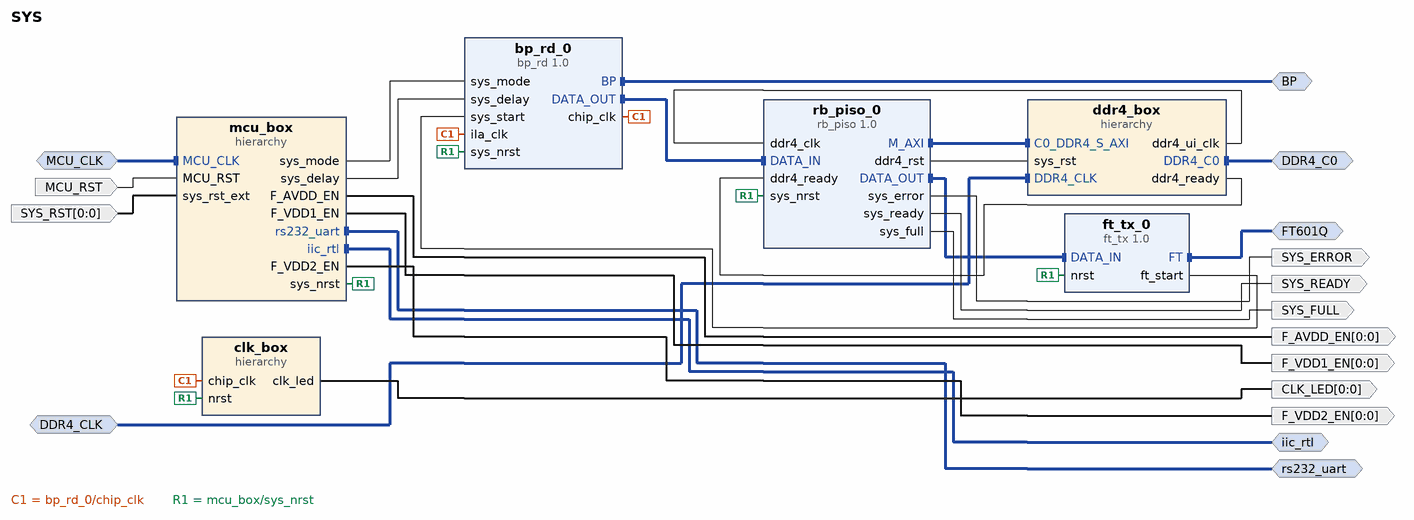
[diagram p0: block diagram of the top level]
# Vivado block design SYS, xcvu9p-flga2104-2L-e, Vivado 2019.1
create_bd_design SYS

create_bd_intf_port -mode Master -vlnv xilinx.com:user:FT601Q_rtl:1.0 FT601Q
create_bd_intf_port -mode Master -vlnv xilinx.com:user:BlackPearl_rtl:1.0 BP
create_bd_intf_port -mode Master -vlnv xilinx.com:interface:ddr4_rtl:1.0 DDR4_C0
create_bd_intf_port -mode Slave -vlnv xilinx.com:interface:diff_clock_rtl:1.0 DDR4_CLK
set_property -dict {CONFIG.FREQ_HZ 250000000} [get_bd_intf_ports DDR4_CLK]
create_bd_intf_port -mode Slave -vlnv xilinx.com:interface:diff_clock_rtl:1.0 MCU_CLK
set_property -dict {CONFIG.FREQ_HZ 250000000} [get_bd_intf_ports MCU_CLK]
create_bd_intf_port -mode Master -vlnv xilinx.com:interface:uart_rtl:1.0 rs232_uart
create_bd_intf_port -mode Master -vlnv xilinx.com:interface:iic_rtl:1.0 iic_rtl
create_bd_port -dir O SYS_READY
create_bd_port -dir O SYS_ERROR
create_bd_port -dir O SYS_FULL
create_bd_port -dir I -from 0 -to 0 SYS_RST
create_bd_port -dir O -from 0 -to 0 CLK_LED
create_bd_port -dir I -type rst MCU_RST
set_property -dict {CONFIG.POLARITY ACTIVE_HIGH} [get_bd_ports MCU_RST]
create_bd_port -dir O -from 0 -to 0 F_AVDD_EN
create_bd_port -dir O -from 0 -to 0 F_VDD1_EN
create_bd_port -dir O -from 0 -to 0 F_VDD2_EN

create_bd_cell -type hier clk_box
create_bd_cell -type hier mcu_box
create_bd_cell -type hier ddr4_box
create_bd_cell -type ip -vlnv xilinx.com:user:rb_piso:1.0 rb_piso_0
create_bd_cell -type ip -vlnv xilinx.com:user:ft_tx:1.0 ft_tx_0
create_bd_cell -type ip -vlnv xilinx.com:user:bp_rd:1.0 bp_rd_0

# ---- hierarchy /clk_box ----
current_bd_instance /clk_box
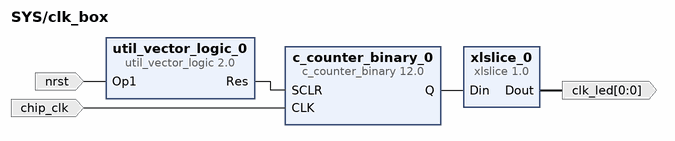
[diagram p1: block diagram inside /clk_box]
create_bd_pin -dir I -type clk chip_clk
create_bd_pin -dir I -type rst nrst
create_bd_pin -dir O -from 0 -to 0 clk_led

create_bd_cell -type ip -vlnv xilinx.com:ip:c_counter_binary:12.0 c_counter_binary_0
set_property -dict {CONFIG.Output_Width 26 CONFIG.SCLR true} [get_bd_cells c_counter_binary_0]
create_bd_cell -type ip -vlnv xilinx.com:ip:xlslice:1.0 xlslice_0
set_property -dict {CONFIG.DIN_FROM 25 CONFIG.DIN_TO 25 CONFIG.DIN_WIDTH 26 CONFIG.DOUT_WIDTH 1} [get_bd_cells xlslice_0]
create_bd_cell -type ip -vlnv xilinx.com:ip:util_vector_logic:2.0 util_vector_logic_0
set_property -dict {CONFIG.C_OPERATION not CONFIG.C_SIZE 1} [get_bd_cells util_vector_logic_0]

# ---- hierarchy /mcu_box ----
current_bd_instance /mcu_box
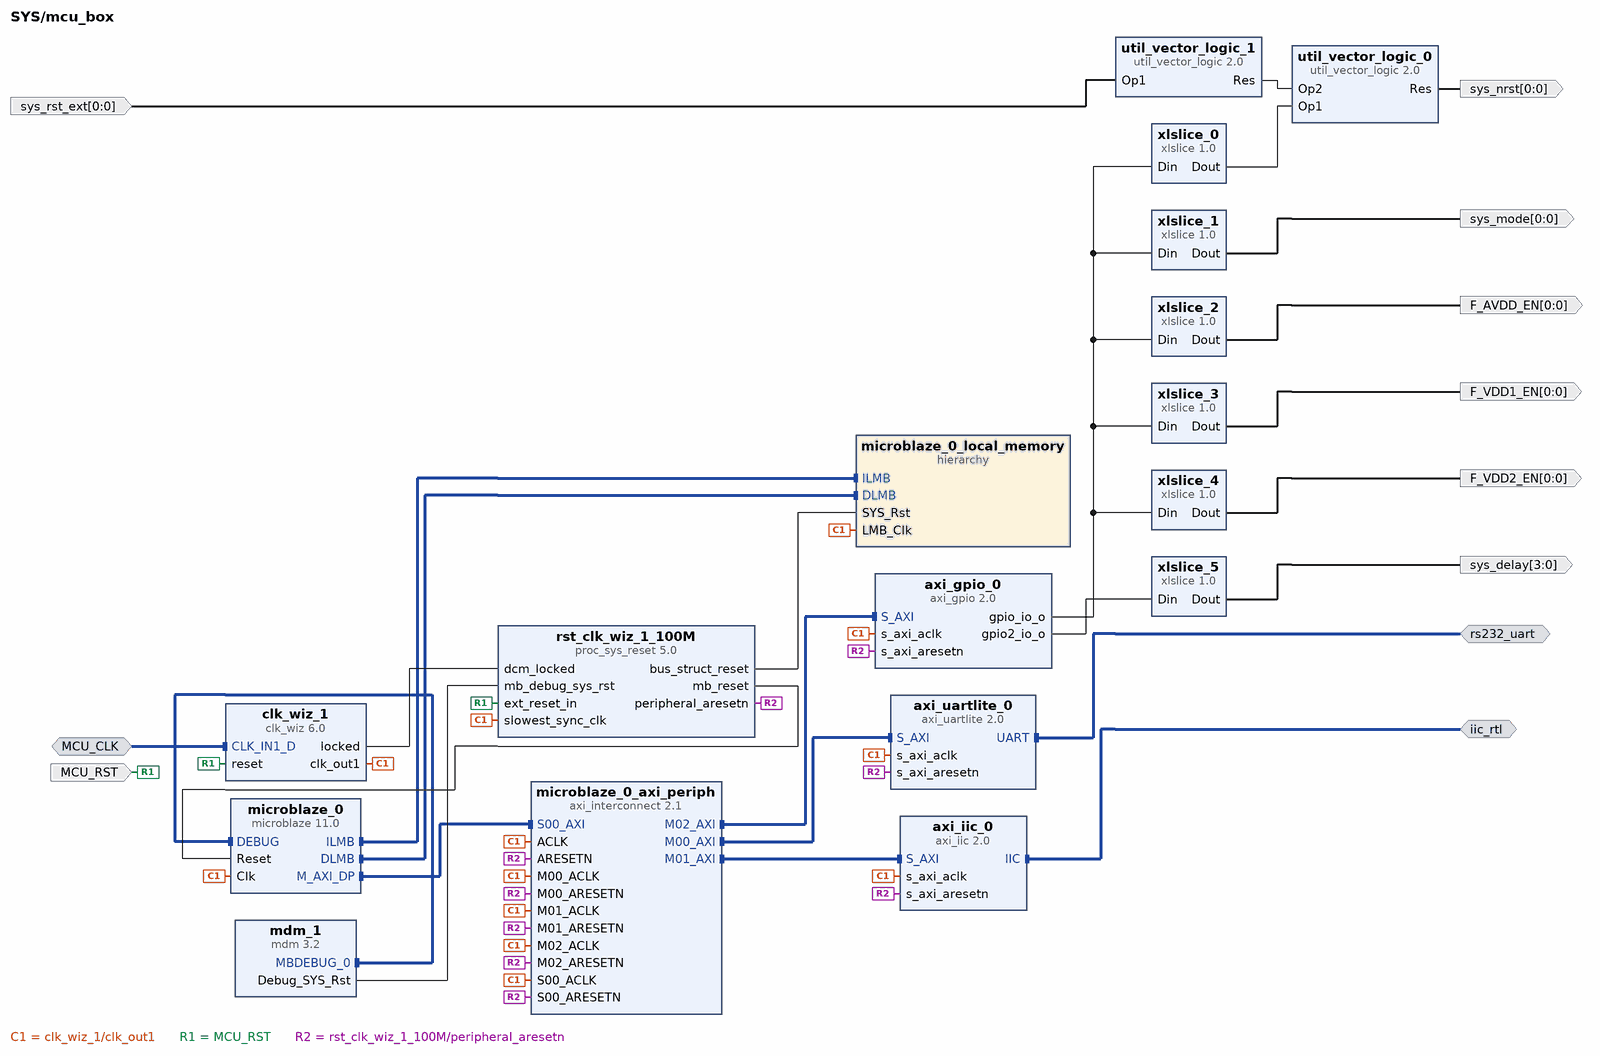
[diagram p2: block diagram inside /mcu_box]
create_bd_intf_pin -mode Slave -vlnv xilinx.com:interface:diff_clock_rtl:1.0 MCU_CLK
create_bd_intf_pin -mode Master -vlnv xilinx.com:interface:uart_rtl:1.0 rs232_uart
create_bd_intf_pin -mode Master -vlnv xilinx.com:interface:iic_rtl:1.0 iic_rtl
create_bd_pin -dir I -type rst MCU_RST
create_bd_pin -dir I -from 0 -to 0 sys_rst_ext
create_bd_pin -dir O -from 0 -to 0 sys_nrst
create_bd_pin -dir O -from 0 -to 0 sys_mode
create_bd_pin -dir O -from 3 -to 0 sys_delay
create_bd_pin -dir O -from 0 -to 0 F_AVDD_EN
create_bd_pin -dir O -from 0 -to 0 F_VDD1_EN
create_bd_pin -dir O -from 0 -to 0 F_VDD2_EN

create_bd_cell -type ip -vlnv xilinx.com:ip:clk_wiz:6.0 clk_wiz_1
set_property -dict [list \
  CONFIG.CLK_IN1_BOARD_INTERFACE default_250mhz_clk1 \
  CONFIG.PRIM_SOURCE Differential_clock_capable_pin \
  CONFIG.RESET_BOARD_INTERFACE reset \
  CONFIG.USE_BOARD_FLOW true \
] [get_bd_cells clk_wiz_1]
create_bd_cell -type ip -vlnv xilinx.com:ip:mdm:3.2 mdm_1
create_bd_cell -type ip -vlnv xilinx.com:ip:microblaze:11.0 microblaze_0
set_property -dict [list \
  CONFIG.C_ADDR_TAG_BITS 0 \
  CONFIG.C_DCACHE_ADDR_TAG 0 \
  CONFIG.C_DEBUG_ENABLED 1 \
  CONFIG.C_D_AXI 1 \
  CONFIG.C_D_LMB 1 \
  CONFIG.C_I_LMB 1 \
  CONFIG.C_USE_DCACHE 0 \
  CONFIG.C_USE_ICACHE 0 \
] [get_bd_cells microblaze_0]
create_bd_cell -type ip -vlnv xilinx.com:ip:proc_sys_reset:5.0 rst_clk_wiz_1_100M
set_property -dict {CONFIG.RESET_BOARD_INTERFACE reset CONFIG.USE_BOARD_FLOW true} [get_bd_cells rst_clk_wiz_1_100M]
create_bd_cell -type hier microblaze_0_local_memory
create_bd_cell -type ip -vlnv xilinx.com:ip:axi_uartlite:2.0 axi_uartlite_0
set_property -dict [list \
  CONFIG.C_BAUDRATE 115200 \
  CONFIG.UARTLITE_BOARD_INTERFACE rs232_uart \
  CONFIG.USE_BOARD_FLOW true \
] [get_bd_cells axi_uartlite_0]
create_bd_cell -type ip -vlnv xilinx.com:ip:axi_interconnect:2.1 microblaze_0_axi_periph
set_property -dict {CONFIG.NUM_MI 3} [get_bd_cells microblaze_0_axi_periph]
create_bd_cell -type ip -vlnv xilinx.com:ip:axi_iic:2.0 axi_iic_0
set_property -dict {CONFIG.IIC_BOARD_INTERFACE Custom CONFIG.USE_BOARD_FLOW true} [get_bd_cells axi_iic_0]
create_bd_cell -type ip -vlnv xilinx.com:ip:axi_gpio:2.0 axi_gpio_0
set_property -dict [list \
  CONFIG.C_ALL_OUTPUTS 1 \
  CONFIG.C_ALL_OUTPUTS_2 1 \
  CONFIG.C_DOUT_DEFAULT 0x00000001 \
  CONFIG.C_IS_DUAL 1 \
  CONFIG.GPIO_BOARD_INTERFACE Custom \
  CONFIG.USE_BOARD_FLOW true \
] [get_bd_cells axi_gpio_0]
create_bd_cell -type ip -vlnv xilinx.com:ip:util_vector_logic:2.0 util_vector_logic_0
set_property -dict {CONFIG.C_SIZE 1} [get_bd_cells util_vector_logic_0]
create_bd_cell -type ip -vlnv xilinx.com:ip:util_vector_logic:2.0 util_vector_logic_1
set_property -dict {CONFIG.C_OPERATION not CONFIG.C_SIZE 1} [get_bd_cells util_vector_logic_1]
create_bd_cell -type ip -vlnv xilinx.com:ip:xlslice:1.0 xlslice_0
create_bd_cell -type ip -vlnv xilinx.com:ip:xlslice:1.0 xlslice_1
set_property -dict {CONFIG.DIN_FROM 1 CONFIG.DIN_TO 1 CONFIG.DOUT_WIDTH 1} [get_bd_cells xlslice_1]
create_bd_cell -type ip -vlnv xilinx.com:ip:xlslice:1.0 xlslice_2
set_property -dict {CONFIG.DIN_FROM 2 CONFIG.DIN_TO 2 CONFIG.DOUT_WIDTH 1} [get_bd_cells xlslice_2]
create_bd_cell -type ip -vlnv xilinx.com:ip:xlslice:1.0 xlslice_3
set_property -dict {CONFIG.DIN_FROM 3 CONFIG.DIN_TO 3 CONFIG.DOUT_WIDTH 1} [get_bd_cells xlslice_3]
create_bd_cell -type ip -vlnv xilinx.com:ip:xlslice:1.0 xlslice_4
set_property -dict {CONFIG.DIN_FROM 4 CONFIG.DIN_TO 4 CONFIG.DOUT_WIDTH 1} [get_bd_cells xlslice_4]
create_bd_cell -type ip -vlnv xilinx.com:ip:xlslice:1.0 xlslice_5
set_property -dict {CONFIG.DIN_FROM 3 CONFIG.DIN_TO 0 CONFIG.DOUT_WIDTH 4} [get_bd_cells xlslice_5]

# ---- hierarchy /mcu_box/microblaze_0_local_memory ----
current_bd_instance /mcu_box/microblaze_0_local_memory
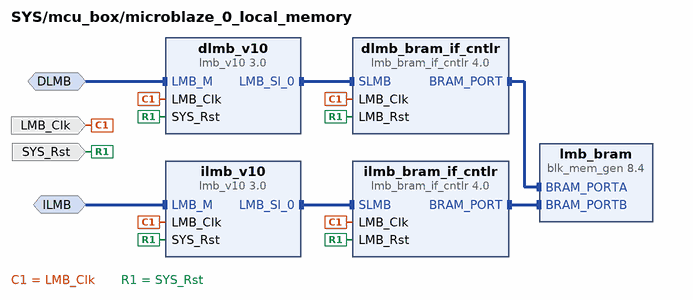
[diagram p3: block diagram inside /mcu_box/microblaze_0_local_memory]
create_bd_intf_pin -mode MirroredMaster -vlnv xilinx.com:interface:lmb_rtl:1.0 DLMB
create_bd_intf_pin -mode MirroredMaster -vlnv xilinx.com:interface:lmb_rtl:1.0 ILMB
create_bd_pin -dir I -type clk LMB_Clk
create_bd_pin -dir I -type rst SYS_Rst

create_bd_cell -type ip -vlnv xilinx.com:ip:lmb_v10:3.0 dlmb_v10
create_bd_cell -type ip -vlnv xilinx.com:ip:lmb_v10:3.0 ilmb_v10
create_bd_cell -type ip -vlnv xilinx.com:ip:lmb_bram_if_cntlr:4.0 dlmb_bram_if_cntlr
set_property -dict {CONFIG.C_ECC 0} [get_bd_cells dlmb_bram_if_cntlr]
create_bd_cell -type ip -vlnv xilinx.com:ip:lmb_bram_if_cntlr:4.0 ilmb_bram_if_cntlr
set_property -dict {CONFIG.C_ECC 0} [get_bd_cells ilmb_bram_if_cntlr]
create_bd_cell -type ip -vlnv xilinx.com:ip:blk_mem_gen:8.4 lmb_bram
set_property -dict {CONFIG.Memory_Type True_Dual_Port_RAM CONFIG.use_bram_block BRAM_Controller} [get_bd_cells lmb_bram]

# ---- hierarchy /ddr4_box ----
current_bd_instance /ddr4_box
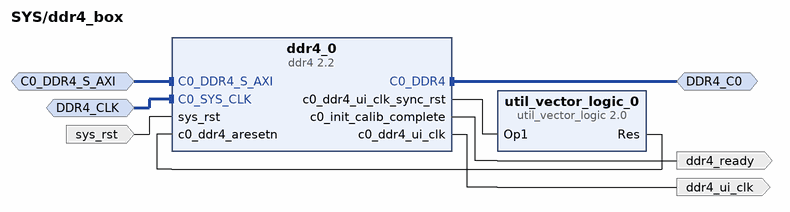
[diagram p4: block diagram inside /ddr4_box]
create_bd_intf_pin -mode Slave -vlnv xilinx.com:interface:diff_clock_rtl:1.0 DDR4_CLK
create_bd_intf_pin -mode Master -vlnv xilinx.com:interface:ddr4_rtl:1.0 DDR4_C0
create_bd_intf_pin -mode Slave -vlnv xilinx.com:interface:aximm_rtl:1.0 C0_DDR4_S_AXI
create_bd_pin -dir O ddr4_ready
create_bd_pin -dir O -type clk ddr4_ui_clk
create_bd_pin -dir I -type rst sys_rst

create_bd_cell -type ip -vlnv xilinx.com:ip:ddr4:2.2 ddr4_0
set_property -dict [list \
  CONFIG.ADDN_UI_CLKOUT1_FREQ_HZ 100 \
  CONFIG.C0_CLOCK_BOARD_INTERFACE default_250mhz_clk2 \
  CONFIG.C0_DDR4_BOARD_INTERFACE ddr4_sdram_c2 \
] [get_bd_cells ddr4_0]
create_bd_cell -type ip -vlnv xilinx.com:ip:util_vector_logic:2.0 util_vector_logic_0
set_property -dict {CONFIG.C_OPERATION not CONFIG.C_SIZE 1} [get_bd_cells util_vector_logic_0]

# ---- connections ----

current_bd_instance /clk_box
connect_bd_net [get_bd_pins c_counter_binary_0/Q] [get_bd_pins xlslice_0/Din]
connect_bd_net -net CLK_0_1 [get_bd_pins chip_clk] [get_bd_pins c_counter_binary_0/CLK]
connect_bd_net [get_bd_pins nrst] [get_bd_pins util_vector_logic_0/Op1]
connect_bd_net [get_bd_pins util_vector_logic_0/Res] [get_bd_pins c_counter_binary_0/SCLR]
connect_bd_net [get_bd_pins xlslice_0/Dout] [get_bd_pins clk_led]

current_bd_instance /mcu_box
connect_bd_intf_net [get_bd_intf_pins microblaze_0_axi_periph/M02_AXI] [get_bd_intf_pins axi_gpio_0/S_AXI]
connect_bd_intf_net [get_bd_intf_pins microblaze_0_axi_periph/M00_AXI] [get_bd_intf_pins axi_uartlite_0/S_AXI]
connect_bd_intf_net [get_bd_intf_pins microblaze_0_axi_periph/M01_AXI] [get_bd_intf_pins axi_iic_0/S_AXI]
connect_bd_intf_net -intf_net default_250mhz_clk1_2 [get_bd_intf_pins MCU_CLK] [get_bd_intf_pins clk_wiz_1/CLK_IN1_D]
connect_bd_intf_net [get_bd_intf_pins microblaze_0/ILMB] [get_bd_intf_pins microblaze_0_local_memory/ILMB]
connect_bd_intf_net [get_bd_intf_pins microblaze_0/M_AXI_DP] [get_bd_intf_pins microblaze_0_axi_periph/S00_AXI]
connect_bd_intf_net [get_bd_intf_pins mdm_1/MBDEBUG_0] [get_bd_intf_pins microblaze_0/DEBUG]
connect_bd_intf_net [get_bd_intf_pins iic_rtl] [get_bd_intf_pins axi_iic_0/IIC]
connect_bd_intf_net [get_bd_intf_pins microblaze_0/DLMB] [get_bd_intf_pins microblaze_0_local_memory/DLMB]
connect_bd_intf_net [get_bd_intf_pins rs232_uart] [get_bd_intf_pins axi_uartlite_0/UART]
connect_bd_net -net microblaze_0_Clk [get_bd_pins clk_wiz_1/clk_out1] \
  [get_bd_pins microblaze_0/Clk] [get_bd_pins microblaze_0_local_memory/LMB_Clk] \
  [get_bd_pins rst_clk_wiz_1_100M/slowest_sync_clk] [get_bd_pins microblaze_0_axi_periph/S00_ACLK] \
  [get_bd_pins axi_uartlite_0/s_axi_aclk] [get_bd_pins microblaze_0_axi_periph/M00_ACLK] \
  [get_bd_pins microblaze_0_axi_periph/ACLK] [get_bd_pins axi_iic_0/s_axi_aclk] \
  [get_bd_pins microblaze_0_axi_periph/M01_ACLK] [get_bd_pins axi_gpio_0/s_axi_aclk] \
  [get_bd_pins microblaze_0_axi_periph/M02_ACLK]
connect_bd_net [get_bd_pins clk_wiz_1/locked] [get_bd_pins rst_clk_wiz_1_100M/dcm_locked]
connect_bd_net [get_bd_pins mdm_1/Debug_SYS_Rst] [get_bd_pins rst_clk_wiz_1_100M/mb_debug_sys_rst]
connect_bd_net [get_bd_pins rst_clk_wiz_1_100M/mb_reset] [get_bd_pins microblaze_0/Reset]
connect_bd_net [get_bd_pins rst_clk_wiz_1_100M/bus_struct_reset] [get_bd_pins microblaze_0_local_memory/SYS_Rst]
connect_bd_net -net reset_1 [get_bd_pins MCU_RST] [get_bd_pins rst_clk_wiz_1_100M/ext_reset_in] [get_bd_pins clk_wiz_1/reset]
connect_bd_net [get_bd_pins rst_clk_wiz_1_100M/peripheral_aresetn] \
  [get_bd_pins microblaze_0_axi_periph/S00_ARESETN] [get_bd_pins axi_uartlite_0/s_axi_aresetn] \
  [get_bd_pins microblaze_0_axi_periph/M00_ARESETN] [get_bd_pins microblaze_0_axi_periph/ARESETN] \
  [get_bd_pins axi_iic_0/s_axi_aresetn] [get_bd_pins microblaze_0_axi_periph/M01_ARESETN] \
  [get_bd_pins axi_gpio_0/s_axi_aresetn] [get_bd_pins microblaze_0_axi_periph/M02_ARESETN]
connect_bd_net -net Op1_0_1 [get_bd_pins sys_rst_ext] [get_bd_pins util_vector_logic_1/Op1]
connect_bd_net [get_bd_pins util_vector_logic_1/Res] [get_bd_pins util_vector_logic_0/Op2]
connect_bd_net [get_bd_pins util_vector_logic_0/Res] [get_bd_pins sys_nrst]
connect_bd_net [get_bd_pins axi_gpio_0/gpio_io_o] \
  [get_bd_pins xlslice_0/Din] [get_bd_pins xlslice_1/Din] [get_bd_pins xlslice_2/Din] [get_bd_pins xlslice_3/Din] \
  [get_bd_pins xlslice_4/Din]
connect_bd_net [get_bd_pins xlslice_0/Dout] [get_bd_pins util_vector_logic_0/Op1]
connect_bd_net [get_bd_pins xlslice_1/Dout] [get_bd_pins sys_mode]
connect_bd_net [get_bd_pins axi_gpio_0/gpio2_io_o] [get_bd_pins xlslice_5/Din]
connect_bd_net [get_bd_pins xlslice_5/Dout] [get_bd_pins sys_delay]
connect_bd_net [get_bd_pins xlslice_2/Dout] [get_bd_pins F_AVDD_EN]
connect_bd_net [get_bd_pins xlslice_3/Dout] [get_bd_pins F_VDD1_EN]
connect_bd_net [get_bd_pins xlslice_4/Dout] [get_bd_pins F_VDD2_EN]
set_property HDL_ATTRIBUTE.BMM_INFO_PROCESSOR {microblaze-le > SYS mcu_box/microblaze_0_local_memory/dlmb_bram_if_cntlr} [get_bd_cells microblaze_0]
set_property HDL_ATTRIBUTE.KEEP_HIERARCHY yes [get_bd_cells microblaze_0]

current_bd_instance /mcu_box/microblaze_0_local_memory
connect_bd_intf_net -intf_net microblaze_0_dlmb [get_bd_intf_pins DLMB] [get_bd_intf_pins dlmb_v10/LMB_M]
connect_bd_intf_net -intf_net microblaze_0_ilmb_bus [get_bd_intf_pins ilmb_v10/LMB_Sl_0] [get_bd_intf_pins ilmb_bram_if_cntlr/SLMB]
connect_bd_intf_net -intf_net microblaze_0_ilmb_cntlr [get_bd_intf_pins ilmb_bram_if_cntlr/BRAM_PORT] [get_bd_intf_pins lmb_bram/BRAM_PORTB]
connect_bd_intf_net -intf_net microblaze_0_dlmb_cntlr [get_bd_intf_pins dlmb_bram_if_cntlr/BRAM_PORT] [get_bd_intf_pins lmb_bram/BRAM_PORTA]
connect_bd_intf_net -intf_net microblaze_0_ilmb [get_bd_intf_pins ILMB] [get_bd_intf_pins ilmb_v10/LMB_M]
connect_bd_intf_net -intf_net microblaze_0_dlmb_bus [get_bd_intf_pins dlmb_v10/LMB_Sl_0] [get_bd_intf_pins dlmb_bram_if_cntlr/SLMB]
connect_bd_net -net microblaze_0_Clk [get_bd_pins LMB_Clk] \
  [get_bd_pins dlmb_v10/LMB_Clk] [get_bd_pins dlmb_bram_if_cntlr/LMB_Clk] [get_bd_pins ilmb_v10/LMB_Clk] \
  [get_bd_pins ilmb_bram_if_cntlr/LMB_Clk]
connect_bd_net [get_bd_pins SYS_Rst] \
  [get_bd_pins dlmb_v10/SYS_Rst] [get_bd_pins dlmb_bram_if_cntlr/LMB_Rst] [get_bd_pins ilmb_v10/SYS_Rst] \
  [get_bd_pins ilmb_bram_if_cntlr/LMB_Rst]
set_property HDL_ATTRIBUTE.BMM_INFO_ADDRESS_SPACE {byte  0x00000000 32 > SYS mcu_box/microblaze_0_local_memory/lmb_bram} [get_bd_cells dlmb_bram_if_cntlr]
set_property HDL_ATTRIBUTE.KEEP_HIERARCHY yes [get_bd_cells dlmb_bram_if_cntlr]

current_bd_instance /ddr4_box
connect_bd_intf_net -intf_net rb_piso_0_M_AXI [get_bd_intf_pins C0_DDR4_S_AXI] [get_bd_intf_pins ddr4_0/C0_DDR4_S_AXI]
connect_bd_intf_net [get_bd_intf_pins DDR4_C0] [get_bd_intf_pins ddr4_0/C0_DDR4]
connect_bd_intf_net -intf_net default_250mhz_clk1_1 [get_bd_intf_pins DDR4_CLK] [get_bd_intf_pins ddr4_0/C0_SYS_CLK]
connect_bd_net [get_bd_pins ddr4_0/c0_ddr4_ui_clk_sync_rst] [get_bd_pins util_vector_logic_0/Op1]
connect_bd_net [get_bd_pins util_vector_logic_0/Res] [get_bd_pins ddr4_0/c0_ddr4_aresetn]
connect_bd_net [get_bd_pins ddr4_0/c0_init_calib_complete] [get_bd_pins ddr4_ready]
connect_bd_net [get_bd_pins ddr4_0/c0_ddr4_ui_clk] [get_bd_pins ddr4_ui_clk]
connect_bd_net -net rb_piso_0_ddr4_rst [get_bd_pins sys_rst] [get_bd_pins ddr4_0/sys_rst]

current_bd_instance /
connect_bd_intf_net [get_bd_intf_ports BP] [get_bd_intf_pins bp_rd_0/BP]
connect_bd_intf_net [get_bd_intf_pins ft_tx_0/DATA_IN] [get_bd_intf_pins rb_piso_0/DATA_OUT]
connect_bd_intf_net [get_bd_intf_ports FT601Q] [get_bd_intf_pins ft_tx_0/FT]
connect_bd_intf_net [get_bd_intf_ports rs232_uart] [get_bd_intf_pins mcu_box/rs232_uart]
connect_bd_intf_net [get_bd_intf_ports iic_rtl] [get_bd_intf_pins mcu_box/iic_rtl]
connect_bd_intf_net -intf_net default_250mhz_clk1_1 [get_bd_intf_ports DDR4_CLK] [get_bd_intf_pins ddr4_box/DDR4_CLK]
connect_bd_intf_net [get_bd_intf_pins rb_piso_0/M_AXI] [get_bd_intf_pins ddr4_box/C0_DDR4_S_AXI]
connect_bd_intf_net [get_bd_intf_pins bp_rd_0/DATA_OUT] [get_bd_intf_pins rb_piso_0/DATA_IN]
connect_bd_intf_net -intf_net ddr4_0_C0_DDR4 [get_bd_intf_ports DDR4_C0] [get_bd_intf_pins ddr4_box/DDR4_C0]
connect_bd_intf_net -intf_net default_250mhz_clk1_2 [get_bd_intf_ports MCU_CLK] [get_bd_intf_pins mcu_box/MCU_CLK]
connect_bd_net [get_bd_pins bp_rd_0/chip_clk] [get_bd_pins clk_box/chip_clk] [get_bd_pins bp_rd_0/ila_clk]
connect_bd_net [get_bd_pins rb_piso_0/ddr4_rst] [get_bd_pins ddr4_box/sys_rst]
connect_bd_net [get_bd_pins rb_piso_0/sys_ready] [get_bd_ports SYS_READY]
connect_bd_net [get_bd_pins rb_piso_0/sys_error] [get_bd_ports SYS_ERROR]
connect_bd_net [get_bd_pins rb_piso_0/sys_full] [get_bd_ports SYS_FULL]
connect_bd_net -net ddr4_0_c0_ddr4_ui_clk [get_bd_pins ddr4_box/ddr4_ui_clk] [get_bd_pins rb_piso_0/ddr4_clk]
connect_bd_net -net ddr4_0_c0_init_calib_complete [get_bd_pins ddr4_box/ddr4_ready] [get_bd_pins rb_piso_0/ddr4_ready]
connect_bd_net -net clk_box_Dout_0 [get_bd_pins clk_box/clk_led] [get_bd_ports CLK_LED]
connect_bd_net -net reset_1 [get_bd_ports MCU_RST] [get_bd_pins mcu_box/MCU_RST]
connect_bd_net [get_bd_ports SYS_RST] [get_bd_pins mcu_box/sys_rst_ext]
connect_bd_net [get_bd_pins mcu_box/F_AVDD_EN] [get_bd_ports F_AVDD_EN]
connect_bd_net [get_bd_pins mcu_box/F_VDD1_EN] [get_bd_ports F_VDD1_EN]
connect_bd_net [get_bd_pins mcu_box/F_VDD2_EN] [get_bd_ports F_VDD2_EN]
connect_bd_net [get_bd_pins mcu_box/sys_nrst] \
  [get_bd_pins clk_box/nrst] [get_bd_pins rb_piso_0/sys_nrst] [get_bd_pins ft_tx_0/nrst] [get_bd_pins bp_rd_0/sys_nrst]
connect_bd_net [get_bd_pins mcu_box/sys_mode] [get_bd_pins bp_rd_0/sys_mode]
connect_bd_net [get_bd_pins mcu_box/sys_delay] [get_bd_pins bp_rd_0/sys_delay]
connect_bd_net [get_bd_pins ft_tx_0/ft_start] [get_bd_pins bp_rd_0/sys_start]

# ---- address map ----
assign_bd_address -offset 0x00000000 -range 64K -target_address_space [get_bd_addr_spaces mcu_box/microblaze_0/Data] [get_bd_addr_segs mcu_box/microblaze_0_local_memory/dlmb_bram_if_cntlr/SLMB/Mem]
assign_bd_address -offset 0x40000000 -range 64K -target_address_space [get_bd_addr_spaces mcu_box/microblaze_0/Data] [get_bd_addr_segs mcu_box/axi_gpio_0/S_AXI/Reg]
assign_bd_address -offset 0x40600000 -range 64K -target_address_space [get_bd_addr_spaces mcu_box/microblaze_0/Data] [get_bd_addr_segs mcu_box/axi_uartlite_0/S_AXI/Reg]
assign_bd_address -offset 0x40800000 -range 64K -target_address_space [get_bd_addr_spaces mcu_box/microblaze_0/Data] [get_bd_addr_segs mcu_box/axi_iic_0/S_AXI/Reg]
assign_bd_address -offset 0x00000000 -range 64K -target_address_space [get_bd_addr_spaces mcu_box/microblaze_0/Instruction] [get_bd_addr_segs mcu_box/microblaze_0_local_memory/ilmb_bram_if_cntlr/SLMB/Mem]
assign_bd_address -offset 0x00000000 -range 2G -target_address_space [get_bd_addr_spaces rb_piso_0/M_AXI] [get_bd_addr_segs ddr4_box/ddr4_0/C0_DDR4_MEMORY_MAP/C0_DDR4_ADDRESS_BLOCK]

validate_bd_design
save_bd_design
